# Altium schematic sheet TIVA Pin Out.SchDoc
size A
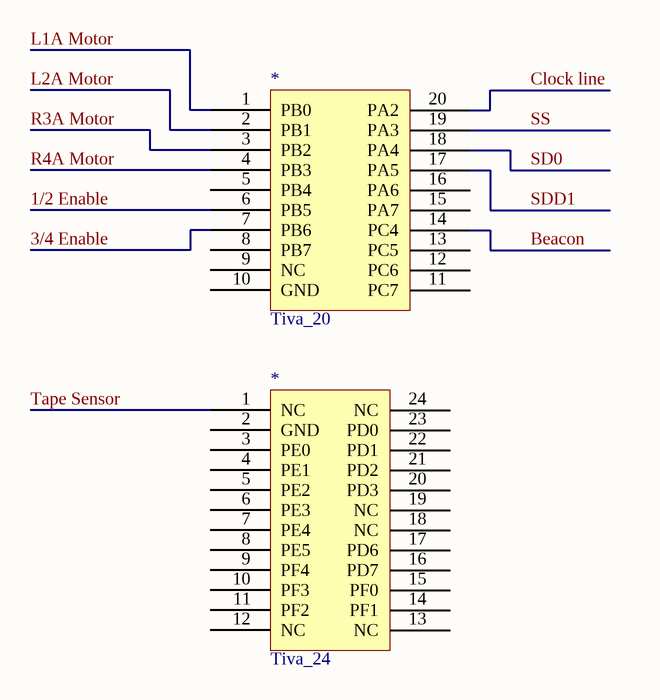
[diagram p0: TIVA Pin Out.SchDoc]

## Parts
(Parts that share a designator on the sheet are numbered #1, #2 ... from top to bottom, then left to right.)
*#1  Tiva_20
*#2  Tiva_24

## Nets
1/2 Enable: *#1.6(PB5)
3/4 Enable: *#1.7(PB6)
Beacon: *#1.14(PC4)
Clock line: *#1.20(PA2)
L1A Motor: *#1.1(PB0)
L2A Motor: *#1.2(PB1)
R3A Motor: *#1.3(PB2)
R4A Motor: *#1.4(PB3)
SD0: *#1.18(PA4)
SDD1: *#1.17(PA5)
SS: *#1.19(PA3)
Tape Sensor: *#2.1(NC)

Not connected (* = marked no-connect by the designer): *#1 5(PB4) 8(PB7) 9(NC) 10(GND) 11(PC7) 12(PC6) 13(PC5) 15(PA7) 16(PA6); *#2 2(GND) 3(PE0) 4(PE1) 5(PE2) 6(PE3) 7(PE4) 8(PE5) 9(PF4) 10(PF3) 11(PF2) 12(NC) 13(NC) 14(PF1) 15(PF0) 16(PD7) 17(PD6) 18(NC) 19(NC) 20(PD3) 21(PD2) 22(PD1) 23(PD0) 24(NC)

## Library data of the parts
*#1 = Tiva_20: Tiva Protection 20 Pin Connector
*#2 = Tiva_24: Tiva Protection 24 Pin Connector